# EAGLE design Break (EAGLE 9.6.2)
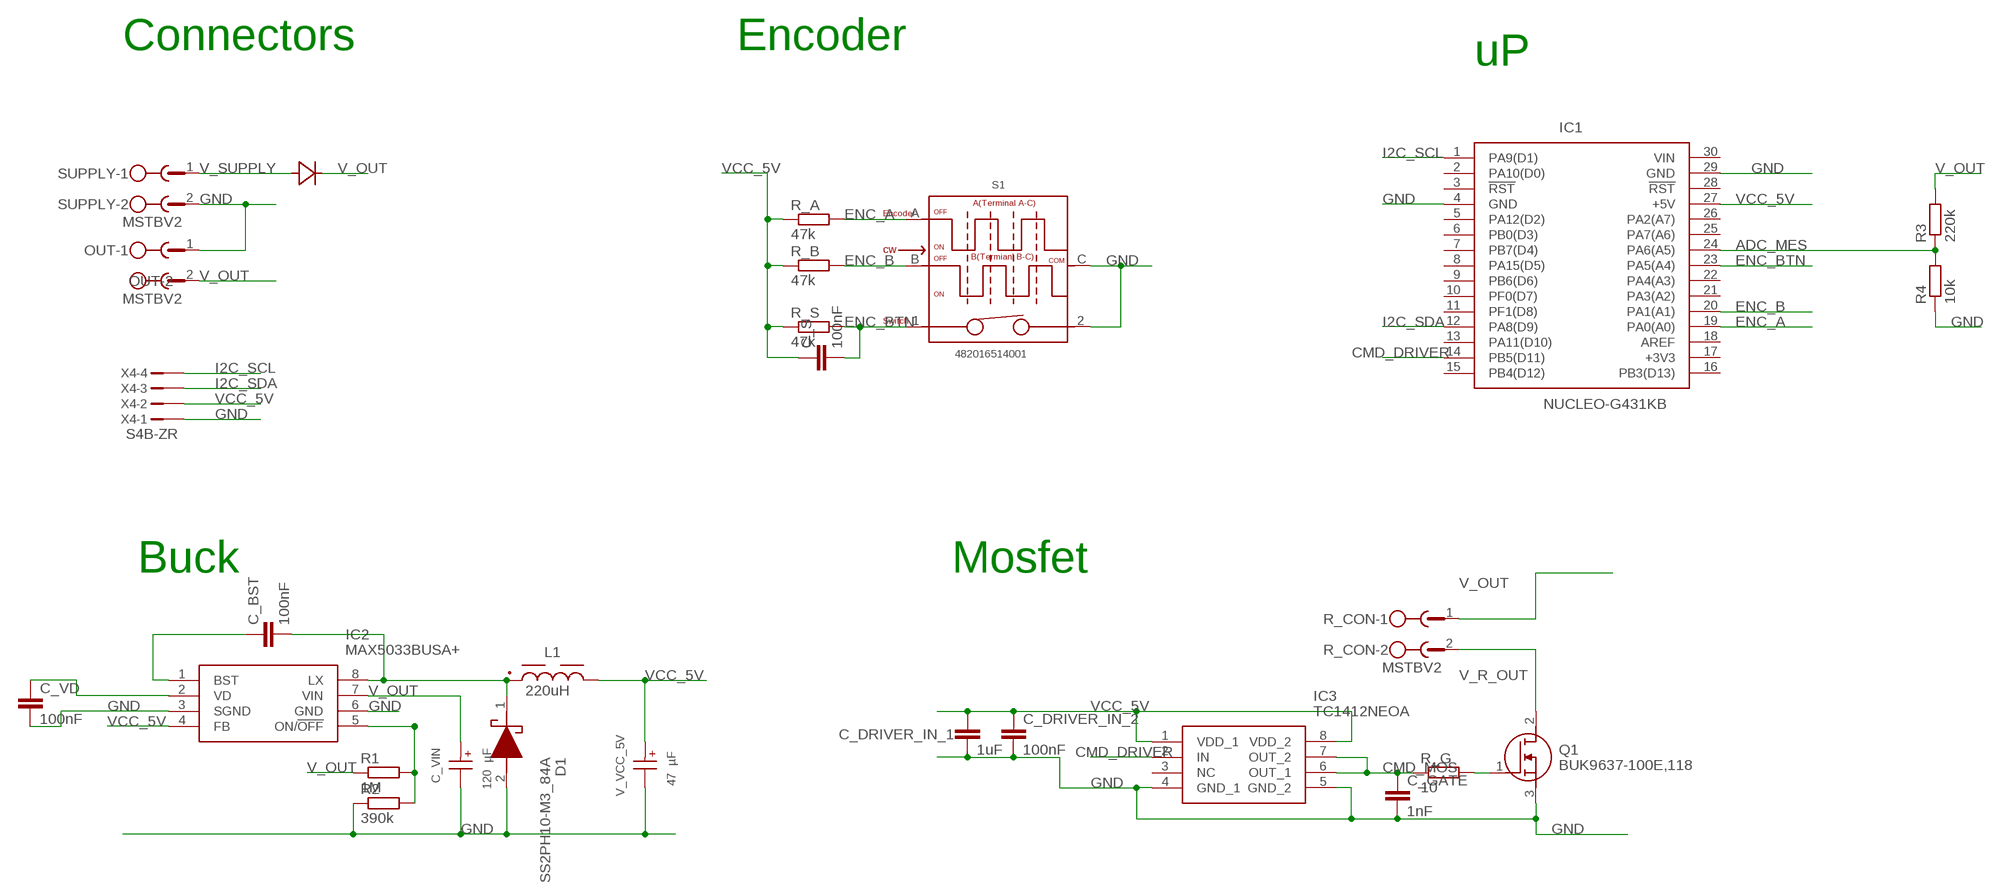
[diagram p0: schematic, sheet 1]

## Parts
C_BST  100nF  C-EUC0603  [C0603]
C_DRIVER_IN_1  1uF  C-EUC0603  [C0603]
C_DRIVER_IN_2  100nF  C-EUC0603  [C0603]
C_GATE  1nF  C-EUC0603  [C0603]
C_S  100nF  C-EUC0603  [C0603]
C_VD  100nF  C-EUC0603  [C0603]
C_VIN  120 µF  WCAP-ATG8_18X41_860011381013  [WCAP-ATG8_18X41X7.5(DXL)]
D1  SS2PH10-M3_84A  [DO-220AA]
IC1  NUCLEO-G431KB  [DIPS1524W66P254L5029H1500Q30N]
IC2  MAX5033BUSA+  [SOIC127P600X175-8N]
IC3  TC1412NEOA  [SOIC127P600X175-8N]
L1  220uH  WE-PDA_1260_784771221  [WE-PDA_1260]
OUT  MSTBV2  [MSTBV2]
Q1  BUK9637-100E,118  [PSMN4R480BS118]
R1  1M  R-EU_R0603  [R0603]
R2  390k  R-EU_R0603  [R0603]
R3  220k  R-EU_R0603  [R0603]
R4  10k  R-EU_R0603  [R0603]
R_A  47k  R-EU_R0603  [R0603]
R_B  47k  R-EU_R0603  [R0603]
R_CON  MSTBV2  [MSTBV2]
R_G  10  R-EU_R1206  [R1206]
R_S  47k  R-EU_R0603  [R0603]
S1  482016514001  [WS-ENTV_4820XX514001]
SUPPLY  MSTBV2  [MSTBV2]
U$1  VS-15TG060S-M3  [SMD-220]
V_VCC_5V  47 µF  WCAP-ASLL_6.3X5.5_865060443004  [WCAP-ASLL_6.3X5.5(DXL)]
X4  S4B-ZR  [S4B-ZR]

## Nets
ADC_MES: IC1.24(PA6(A5)) R3.1 R4.2
CMD_DRIVER: IC1.14(PB5(D11)) IC3.2(IN)
CMD_MOS: C_GATE.1 IC3.6(OUT_1) IC3.7(OUT_2) R_G.1
ENC_A: IC1.19(PA0(A0)) R_A.2 S1.A
ENC_B: IC1.20(PA1(A1)) R_B.2 S1.B
ENC_BTN: C_S.2 IC1.23(PA5(A4)) R_S.2 S1.1
GND: C_DRIVER_IN_1.2 C_DRIVER_IN_2.2 C_GATE.2 C_VD.2 C_VIN.2(-) D1.2(A) IC1.4(GND) IC1.29(GND) IC2.3(SGND) IC2.6(GND) IC3.4(GND_1) IC3.5(GND_2) OUT.1 Q1.3(S) R2.1 R4.1 S1.2 S1.C(COM) SUPPLY.2 V_VCC_5V.2(-) X4.1
I2C_SCL: IC1.1(PA9(D1)) X4.4
I2C_SDA: IC1.12(PA8(D9)) X4.3
N$1: Q1.1(G) R_G.2
N$2: C_BST.2 D1.1(K) IC2.8(LX) L1.1
N$3: C_VD.1 IC2.2(VD)
N$4: C_BST.1 IC2.1(BST)
N$5: IC2.5(ON/!OFF) R1.2 R2.2
V_OUT [High_Voltage]: C_VIN.1(+) IC2.7(VIN) OUT.2 R1.1 R3.2 R_CON.1 U$1.P$4(C)
V_R_OUT [High_Voltage]: Q1.2(D) R_CON.2
V_SUPPLY [High_Voltage]: SUPPLY.1 U$1.P$3(A)
VCC_5V: C_DRIVER_IN_1.1 C_DRIVER_IN_2.1 C_S.1 IC1.27(+5V) IC2.4(FB) IC3.1(VDD_1) IC3.8(VDD_2) L1.2 R_A.1 R_B.1 R_S.1 V_VCC_5V.1(+) X4.2
Unconnected: IC1.2(PA10(D0)) IC1.3(!RST) IC1.5(PA12(D2)) IC1.6(PB0(D3)) IC1.7(PB7(D4)) IC1.8(PA15(D5)) IC1.9(PB6(D6)) IC1.10(PF0(D7)) IC1.11(PF1(D8)) IC1.13(PA11(D10)) IC1.15(PB4(D12)) IC1.16(PB3(D13)) IC1.17(+3V3) IC1.18(AREF) IC1.21(PA3(A2)) IC1.22(PA4(A3)) IC1.25(PA7(A6)) IC1.26(PA2(A7)) IC1.28(!RST) IC1.30(VIN) IC3.3(NC)

## Notes on the sheet
- Connectors | Encoder
- uP
- Buck | Mosfet

## Library data of the parts
C_BST C_DRIVER_IN_1 C_DRIVER_IN_2 C_GATE C_S C_VD = rcl:C-EU: CAPACITOR, European symbol; SPICEPREFIX: C
C_VIN = Eagle_WCAP-ATG8 (rev20a):WCAP-ATG8_18X41: WCAP-ATG8 Aluminium Electrolytic Capacitors General Purpose +85 °C Characteristics General purpose product series with max. operating temperature of +85 °C Wide range of capacitance value Mounting style: THT Radial Capacitance range: 0.1 µF ‒ 33000 µF Capacitance tolerance: ±20 % Voltage range (UR): 10 ‒ 400 V(DC) Operating temperature: -40 °C up to +85 °C for UR < 400 V(DC) -25 °C up to +85 °C for UR ≥ 400 V(DC) Endurance: 2000 h @ +85 °C Dimensions (DxL) in mm: 5.0 x 11.0 up to 22.0 x 51.0 Recommended soldering: Wave soldering Applications Filtering Smoothing Energy storage Coupling <https://www.we-online.com/catalog/media/o35732v209%20WCAP-ATG8_4C.jpg> Details see: https://www.we-online.com/catalog/en/WCAP-ATG8/ Updated by yingchun,Shan;2020-02-27 2020(C) Würth Elektronik; DATASHEET-URL: https://www.we-online.com/catalog/datasheet/860011381013.pdf; DF: 15%; DIAMETER: 18mm; I-LEAK: 1440uA; I-RIPPLE: 520mA; L: 41mm; OPERATING-TEMPERATURE: -40 °C up to +85 °C; PART-NUMBER: 860011381013; PITCH: 7.5mm; TECHNICAL-REFERENCE: ATAL410121M400DSPS1B000; VR: 400V(DC)
D1 = SamacSys_Parts:SS2PH10-M3_84A: VISHAY - SS2PH10-M3/84A - DIODE, RECTIFIER, SCHOTTKY, 2A, 100V, SM Source: Datasheet <https://www.vishay.com/docs/84682/ss2ph9.pdf>; DESCRIPTION: VISHAY - SS2PH10-M3/84A - DIODE, RECTIFIER, SCHOTTKY, 2A, 100V, SM; HEIGHT: mm; MANUFACTURER_NAME: Vishay; MANUFACTURER_PART_NUMBER: SS2PH10-M3/84A; MOUSER_PART_NUMBER: 625-SS2PH10-M3; MOUSER_PRICE-STOCK: https://www.mouser.co.uk/ProductDetail/Vishay-General-Semiconductor/SS2PH10-M3-84A?qs=2u8eEi%2F8yFWdOPY7KNSV1w%3D%3D
IC1 = NUCLEO-G431KB:NUCLEO-G431KB: STM32 Nucleo-32 development board Source: Datasheet <http://www.st.com/content/ccc/resource/technical/document/data_brief/b1/d8/13/d4/b0/b7/4b/6e/DM00214578.pdf/files/DM00214578.pdf/jcr:content/translations/en.DM00214578.pdf>; ARROW_PART_NUMBER: NUCLEO-F303K8; ARROW_PRICE-STOCK: https://www.arrow.com/en/products/nucleo-f303k8/stmicroelectronics; DESCRIPTION: STM32 Nucleo-32 development board; HEIGHT: 15mm; MANUFACTURER_NAME: STMicroelectronics; MANUFACTURER_PART_NUMBER: NUCLEO-F303K8; RS_PART_NUMBER: 9092862; RS_PRICE-STOCK: http://uk.rs-online.com/web/p/products/9092862
IC2 = SamacSys_Parts:MAX5033BUSA+: Maxim MAX5033BUSA+, Step Down DC-DC Converter, 500mA, 8-Pin SOIC Source: Datasheet <https://componentsearchengine.com/Datasheets/2/MAX5033BUSA .pdf>; DESCRIPTION: Maxim MAX5033BUSA+, Step Down DC-DC Converter, 500mA, 8-Pin SOIC; HEIGHT: 1.75mm; MANUFACTURER_NAME: Maxim Integrated; MANUFACTURER_PART_NUMBER: MAX5033BUSA+; MOUSER_PART_NUMBER: 700-MAX5033BUSA; MOUSER_PRICE-STOCK: https://www.mouser.co.uk/ProductDetail/Maxim-Integrated/MAX5033BUSA%2b?qs=Mqkh4jHMT8w8l7AEeL1jAA%3D%3D
IC3 = SamacSys_Parts:TC1412NEOA: MOSFET Driver 2A High-Speed 16V SOIC8 Source: Datasheet <https://datasheet.datasheetarchive.com/originals/distributors/Datasheets-316/599872.pdf>; DESCRIPTION: MOSFET Driver 2A High-Speed 16V SOIC8; HEIGHT: 1.75mm; MANUFACTURER_NAME: Microchip; MANUFACTURER_PART_NUMBER: TC1412NEOA; MOUSER_PART_NUMBER: 579-TC1412NEOA; MOUSER_PRICE-STOCK: https://www.mouser.co.uk/ProductDetail/Microchip-Technology/TC1412NEOA?qs=QQ%252Byn%2FmNCzzaLr%2FfyL5GWw%3D%3D
L1 = Eagle_WE-PDA (rev20b):WE-PDA_1260: WE-PDA SMD Shielded Power Inductor Characteristics Magnetically shielded version which results in a low leakage field High storage capacity High Saturation currents up to 23 A Very low self-losses at high switching frequency's Wide inductance spectrum available at all sizes Operating Temperature -40 °C up to +125 °C Core Material: NiZn Wire connection: welding technology Applications Multimedia applications Switching regulators with low operating voltages Integrated DC/DC-converter Perfect suitable for switching regulators with extremely high efficiency (> 86 %) Plastic base: Because of the one piece construction these are more suitable for high vibration or shock applications <https://www.we-online.com/catalog/media/o55118v209%20Family_WE-PDA.jpg> Details see: https://www.we-online.com/katalog/en/WE-PDA Updated by Ella Wu 2020-03-18 2020(C) Wurth Elektronik; DATASHEET-URL: https://www.we-online.com/catalog/datasheet/784771221.pdf; FRES: 3.9MHz; IR: 0.99A; ISAT: 1.1A; MOUNT: SMT; PART-NUMBER: 784771221; RDC-MAX: 348mOhm; RDC-TYP: 290mOhm
OUT R_CON SUPPLY = con-phoenix-508:MSTBV2: PHOENIX; MPN: MSTBV 2,5/2-GF-5.08; OC_FARNELL: 1792792; OC_NEWARK: 69R9845
Q1 = SamacSys_Parts:BUK9637-100E,118: MOSFET N-channel TrenchMOS logic level FET Source: Datasheet <https://assets.nexperia.com/documents/data-sheet/BUK9608-55A.pdf>; DESCRIPTION: MOSFET N-channel TrenchMOS logic level FET; HEIGHT: mm; MANUFACTURER_NAME: Nexperia; MANUFACTURER_PART_NUMBER: BUK9637-100E,118; MOUSER_PART_NUMBER: 771-BUK9637-100E118; MOUSER_PRICE-STOCK: https://www.mouser.co.uk/ProductDetail/Nexperia/BUK9637-100E118?qs=1sbE9T7hb3az4Qao%252B75HWw%3D%3D
R1-R4 R_A R_B R_G R_S = rcl:R-EU_: RESISTOR, European symbol; SPICEPREFIX: R
S1 = Eagle_WS-ENTV (rev21a):482016514001: WS-ENTV Mechanical Incremental Encoder Switch Mechanical Properties Torque Encoder:200 gf.cm Operation Force:600 g Travel (Value):0.5 mm General Information Operating Temperature:-40 up to +85 °C Packaging Information Packaging:Tray <https://www.we-online.com/catalog/media/o127908v209%20Family_WS-ENTV_482020714001.jpg> Details see: https://www.we-online.com/catalog/en/ENTV_11X13_75X26_6_THT_SHAFT_WITH_BUSHING/ Updated by Yingchun,Shan, 2020-02-27 2020 (C) Wurth Elektronik; DATASHEET-URL: https://www.we-online.com/catalog/datasheet/482016514001.pdf; DETENT: 30 Positions; ELECTRICAL-LIFE-ENCODER: 15000 Cycles; ELECTRICAL-LIFE-SWITCH: 20000 Cycles; PART-NUMBER: 482016514001; RESOLUTION: 15 Pulse/360 degree
U$1 = Custom:VS-15TG060S-M3
V_VCC_5V = Eagle_WCAP-ASLL (rev20a):WCAP-ASLL_6.3X5.5: WCAP-ASLL Aluminium Electrolytic Capacitors Low Impedance & Long Life +105 °C Characteristics Low impedance and long life product series Mounting style: V-Chip SMT Capacitance range: 1 µF ‒ 6800 µF Capacitance tolerance: ±20 % Voltage range (UR): 6.3 ‒ 450 V(DC) Operating temperature: -55 °C up to +105 °C for UR ≤ 100 V(DC) -40 °C up to +105 °C for UR > 100 V(DC) Endurance: 2000 ‒ 5000 h @ +105 °C Dimensions (DxL) in mm: 4.0 x 5.5 up to 16.0 x 17.0 Recommended soldering: Reflow soldering Applications Long life application & low impedance Input and output capacitor for switched-mode power supply Filtering Smoothing e.g. DC/DC converter, AC/DC converter, satellite receiver, control panel <https://www.we-online.com/catalog/media/o14724v209%20Family_WCAP-ASLL.jpg> Details see: https://www.we-online.com/catalog/en/WCAP-ASLL/ Updated by yingchun,Shan;2020-03-03 2020(C) Würth Elektronik; DATASHEET-URL: https://www.we-online.com/catalog/datasheet/865060443004.pdf; DF: 14%; DIAMETER: 6.3mm; I-LEAK: 11.75uA; I-RIPPLE: 230mA; L: 5.5mm; OPERATING-TEMPERATURE: -55 °C up to +105 °C; PART-NUMBER: 865060443004; TECHNICAL-REFERENCE: ASED055470M025DVCTBB000; VR: 25V(DC); Z: 0.44Ohm
X4 = con-jst:?4B-ZR: ZH CONNECTOR 1.5 mm, 4 pin 1 row Source: http://www.jst.com .. eZH.pdf; MF: FARNELL; MPN: S4B-ZR(LF)(SN); OC_FARNELL: 9491830; OC_NEWARK: 38K8076

## Net classes
0 default: width 0.3 mm, clearance 0.3 mm
1 High_Voltage: width 0.6 mm, clearance 0.6 mm

## Board
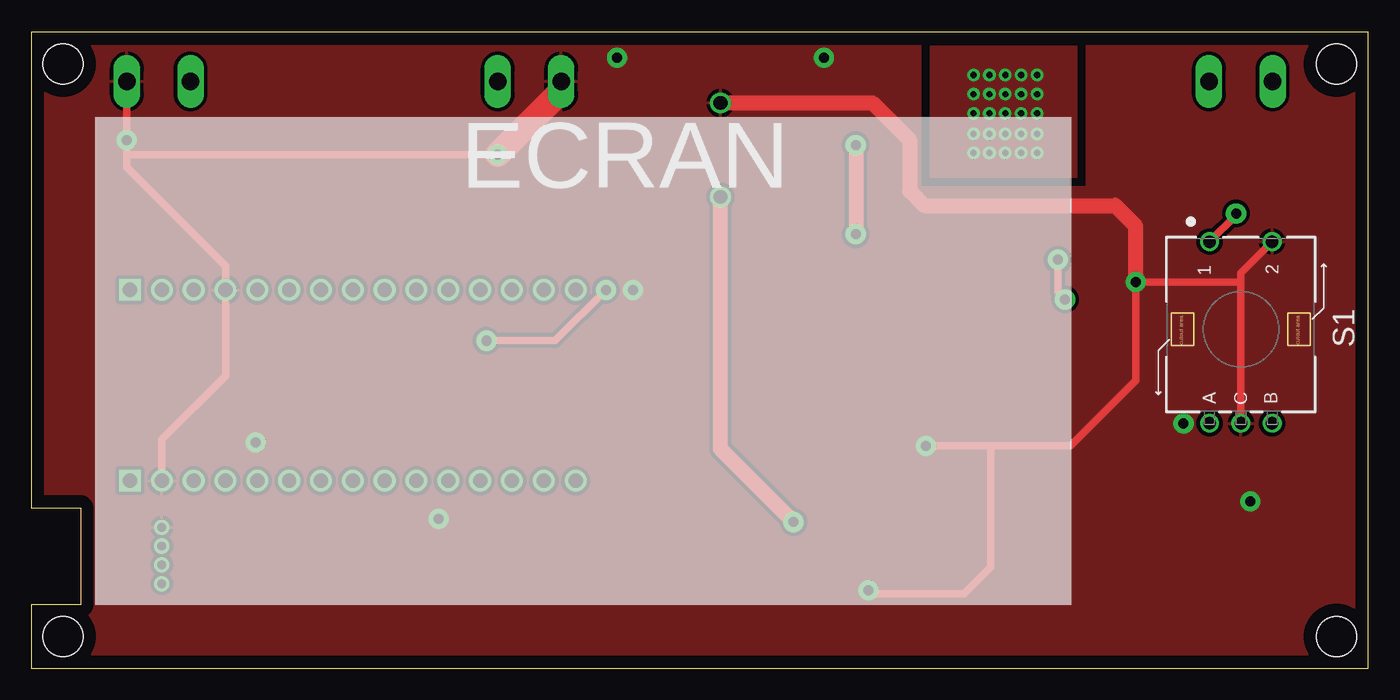
[diagram p1: board, top side]
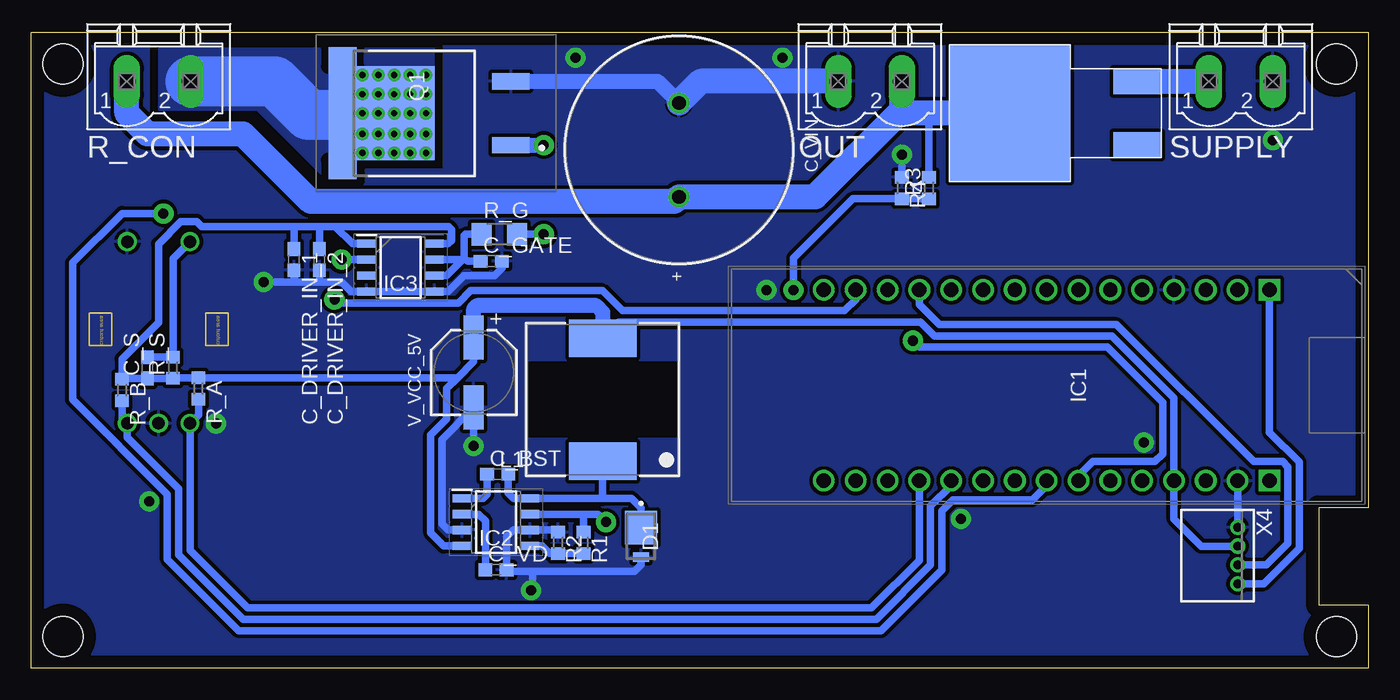
[diagram p2: board, bottom side, seen from below]

Size 106.68 x 50.8 mm. Coordinates in mm from the lower left corner, seen from the top.
Outline: 0,50.8 0,12.83 3.94,12.83 3.94,5.08 0,5.08 0,0 106.68,0 106.68,50.8 0,50.8
Copper layers (1*16): Top 0.035mm / dielectric 1.5mm / Bottom 0.035mm
Design rules "default *": minimum track width 0.3mm, minimum drill 0.5mm, track to track 0.3mm, track to pad 0.3mm, pad to pad 0.3mm, via to via 0.3mm, smd to smd 0.3mm, copper to edge 40mil, drill to drill 6mil, minimum pad ring 10mil, minimum via ring 8mil, stop-mask expansion 4mil, vias tented up to drill 0mil, thermal gap 0.3mm
Holes 3.2 mm at 2.54,2.54 2.54,48.26 104.14,48.26 104.14,2.54

### Footprints (pad centres in the part's own frame; a part is rotated, then mirrored left to right if it is on the bottom)
C0603 = smd 1.1 x 1: 1 -0.85,0; 2 0.85,0
WCAP-ATG8_18X41X7.5(DXL) = drill 1.1: 1 3.75,0; 2 -3.75,0
DO-220AA = smd 2.67 x 2.54: 1 -0.699,0 | smd 0.762 x 1.27: 2 1.653,0
DIPS1524W66P254L5029H1500Q30N = drill 1.15 pad 1.725 square: 1 -7.62,17.78; 30 7.62,17.78 | drill 1.15 pad 1.725: 2 -7.62,15.24; 3 -7.62,12.7; 4 -7.62,10.16; 5 -7.62,7.62; 6 -7.62,5.08; 7 -7.62,2.54; 8 -7.62,0; 9 -7.62,-2.54; 10 -7.62,-5.08; 11 -7.62,-7.62; 12 -7.62,-10.16; 13 -7.62,-12.7; 14 -7.62,-15.24; 15 -7.62,-17.78; 16 7.62,-17.78; 17 7.62,-15.24; 18 7.62,-12.7; 19 7.62,-10.16; 20 7.62,-7.62; 21 7.62,-5.08; 22 7.62,-2.54; 23 7.62,0; 24 7.62,2.54; 25 7.62,5.08; 26 7.62,7.62; 27 7.62,10.16; 28 7.62,12.7; 29 7.62,15.24
SOIC127P600X175-8N = smd 1.5 x 0.65: 1 -2.7,1.905; 2 -2.7,0.635; 3 -2.7,-0.635; 4 -2.7,-1.905; 5 2.7,-1.905; 6 2.7,-0.635; 7 2.7,0.635; 8 2.7,1.905
WE-PDA_1260 = smd 5.4 x 3: 1 0,4.9; 2 0,-4.9
MSTBV2 = drill 1.397 long: 1 -2.54,0; 2 2.54,0
PSMN4R480BS118 = smd 1.3 x 3: 1 -2.54,-10.325; 3 2.54,-10.325 | smd 7.5 x 8.45: 2 0,0 | smd 1.55 x 2.25: 4 -4.5,3.1; 5 4.5,3.1
R0603 = smd 1 x 1.1: 1 -0.85,0; 2 0.85,0
R1206 = smd 1.6 x 1.803: 1 -1.422,0; 2 1.422,0
WS-ENTV_4820XX514001 = drill 1: 1 -7,-2.5; 2 -7,2.5; A 7.5,-2.5; B 7.5,2.5; C 7.5,0
SMD-220 = smd 2.032 x 3.81: P$1 -2.54,-5.08; P$3 2.54,-5.08 | smd 10.922 x 9.652: P$4 0,5.08
WCAP-ASLL_6.3X5.5(DXL) = smd 3.5 x 1.6: 1 2.8,0; 2 -2.8,0
S4B-ZR = drill 0.7 pad 1.1: 1 -2.25,0; 2 -0.75,0; 3 0.75,0; 4 2.25,0

### Placement (x,y rotation side)
C_BST  69.47,15.49 0 bottom
C_DRIVER_IN_1  85.72,32.64 270 bottom
C_DRIVER_IN_2  83.69,32.64 270 bottom
C_GATE  69.98,32.51 0 bottom
C_S  97.41,24 90 bottom
C_VD  69.6,7.87 0 bottom
C_VIN  54.99,41.4 270 bottom
D1  58.04,10.54 270 bottom
IC1  25.65,22.61 270 bottom
IC2  69.6,11.68 0 bottom
IC3  77.22,32 0 bottom
L1  61.09,21.46 180 bottom
OUT  39.75,46.86 0 bottom
Q1  78.74,44.32 90 bottom
R1  62.61,10.03 270 bottom
R2  64.64,10.03 270 bottom
R3  35.05,38.35 90 bottom
R4  37.21,38.35 270 bottom
R_A  93.34,22.35 270 bottom
R_B  99.44,22.23 270 bottom
R_CON  96.52,46.86 0 bottom
R_G  69.34,34.67 0 bottom
R_S  95.38,24 90 bottom
S1  96.52,27.08 270 top
SUPPLY  10.16,46.86 0 bottom
U$1  23.5,44.32 90 bottom
V_VCC_5V  71.37,23.62 90 bottom
X4  10.41,9.02 270 bottom

### Tracks (layer width: path | path; a pad name or v marks a point on that pad's centre or on a via)
ADC_MES  (via drill 0.8 pad 1.6)
  Top 0.6: v45.85,30.23 41.78,26.16 v36.32,26.16
  Bottom 0.6: v45.85,30.23 45.85,32.77 41.11,37.5 R4.2 R3.1 | IC1.24 23.11,15.37 21.97,16.51 17.03,16.51 16.39,17.14 16.39,21.22 20.83,25.65 35.81,25.65 v36.32,26.16
CMD_DRIVER  (via drill 0.8 pad 1.6)
  Top 0.6: v82.5,29.46 81.92,30.04 v81.92,32.64
  Bottom 0.6: IC3.2 v81.92,32.64 | IC1.14 40.89,29.46 41.78,28.57 59.52,28.57 61.1,30.16 71.62,30.16 72.6,29.17 82.21,29.17 v82.5,29.46
CMD_MOS
  Bottom 0.6: IC3.6 73.53,31.37 72.26,32.64 | IC3.7 72.26,32.64 | R_G.1 72.01,34.67 72.14,34.54 72.14,32.77 | 72.14,32.77 72.26,32.64 | C_GATE.1 71.88,32.51 72.14,32.77
ENC_A
  Bottom 0.6: R_A.2 93.34,20.25 S1.A 94.02,9.44 89.41,4.83 39.62,4.83 35.81,8.64 IC1.19
ENC_B
  Bottom 0.6: R_B.2 99.44,20 S1.B 99.02,18.43 94.92,14.33 94.92,9.06 89.78,3.93 39.25,3.93 34.91,8.26 34.91,12.96 33.27,14.61 IC1.20
ENC_BTN  (via drill 0.8 pad 1.6)
  Top 0.6: S1.1 96.14,36.2 v96.14,36.32
  Bottom 0.6: C_S.2 R_S.2 95.38,32.72 S1.1 | IC1.23 25.65,14.61 26.8,13.46 33.12,13.46 34.01,12.57 34.01,7.89 38.88,3.03 90.15,3.03 95.82,8.69 95.82,13.9 103.38,21.46 103.38,32.38 99.44,36.32 v96.14,36.32
GND  (via drill 0.8 pad 1.6)
  Top 0.6: S1.C 96.52,30.86 | 96.52,30.86 96.52,31.58 S1.2 | IC1.29 10.41,18.29 15.49,23.37 IC1.4 15.49,32.13 7.62,40.01 7.62,41.02 | SUPPLY.2 7.62,41.02 | v37.21,41.02 7.62,41.02 | 96.52,30.86 v88.14,30.86 88.14,22.99 82.93,17.78 76.58,17.78 | v71.37,17.78 76.58,17.78 | 76.58,17.78 76.58,8.13 74.42,5.97 66.8,5.97 v66.8,6.23
  Top 1.2: v88.14,30.86 88.14,35.31 86.49,36.96 71.25,36.96 70.1,38.1 70.1,42.16 67.12,45.15 C_VIN.2
  Top 2: OUT.1 42.29,46.1 v37.21,41.02
  Bottom 0.6: C_GATE.2 69.13,31.96 69.72,31.37 72.14,31.37 73.41,30.1 IC3.5 IC3.4 81.15,30.1 81.92,30.86 83.57,30.86 | 83.57,30.86 85.47,30.86 | 85.47,30.86 85.72,31.11 C_DRIVER_IN_1.2 | C_DRIVER_IN_2.2 83.69,30.99 83.57,30.86 | R2.1 64.81,11.05 IC2.6 68.2,11.05 68.75,10.5 C_VD.2 68.62,7.75 66.67,7.75 | IC2.3 73.41,11.05 73.91,11.56 73.91,18.28 V_VCC_5V.2 v71.37,17.78 | D1.2 58.04,8.26 58.55,7.75 66.67,7.75 | X4.1 IC1.29 | R4.1 v37.21,41.02 | v88.14,30.86 85.47,30.86 | v66.8,6.23 66.67,6.35 66.67,7.75
  Bottom 1.2: Q1.3 56.7,46.86 C_VIN.2
  Bottom 2: OUT.1 53.28,46.86 C_VIN.2
  other vias: 32.51,11.94 46.74,48.77 63.25,48.77 97.28,13.34 91.95,19.56 17.91,18.03 7.62,42.16 48.01,30.23
  pour Top (rank 2): 0,0 106.68,0 106.68,50.8 84.2,50.8 84.2,38.48 70.99,38.48 70.99,50.8 0,50.8
  pour Bottom (rank 2): 0,0 106.68,0 106.68,50.8 97.28,50.8 97.28,43.81 89.03,43.81 83.44,38.23 80.52,38.23 80.01,38.73 80.01,39.88 73.79,39.88 73.79,50.8 0,50.8 0,12.83 3.94,12.83 3.94,5.08 0,5.08
I2C_SCL
  Bottom 0.6: X4.4 8.34,6.77 5.51,9.6 5.51,16.47 7.87,18.83 IC1.1
I2C_SDA
  Bottom 0.6: X4.3 8.12,8.27 6.41,9.97 6.41,16.1 6.82,16.51 9.14,16.51 20.09,27.45 34.23,27.45 35.81,29.03 IC1.12
N$1  (via drill 0.8 pad 1.6)
  Top 1.2: v65.79,41.78 v65.79,34.67
  Bottom 0.6: v65.79,34.67 R_G.2
  Bottom 1.2: Q1.1 v65.79,41.78
N$2
  Bottom 0.6: C_BST.2 68.62,14.01 68.2,13.59 IC2.8 60.96,13.59 | L1.1 61.09,13.72 60.96,13.59 | D1.1 58.04,12.83 58.8,13.59 60.96,13.59
N$3
  Bottom 0.6: C_VD.1 70.45,11.77 70.99,12.32 IC2.2
N$4
  Bottom 0.6: IC2.1 70.61,13.59 70.32,13.88 C_BST.1
N$5
  Bottom 0.6: R1.2 R2.2 65.32,9.18 65.91,9.78 IC2.5
V_OUT  (via drill 0.8 pad 1.6)
  Top 1.2: v60.83,11.68 54.99,17.53 C_VIN.1
  Bottom 0.6: IC2.7 62.61,12.32 | 62.61,12.32 R1.1 | 62.61,12.32 61.47,12.32 v60.83,11.68 | R3.2 35.05,44.32
  Bottom 2: U$1.P$4 35.05,44.32 37.21,44.32 37.21,44.58 | 37.21,44.58 OUT.2 | 37.21,44.58 44.14,37.65 C_VIN.1 55.37,37.27 84.39,37.27 89.79,42.67 97.41,42.67 99.06,44.32 R_CON.1
V_R_OUT  (via drill 0.5 pad 1)
  Bottom 0.6: Q1.2 76.45,46.61 v76.45,47.37 | v77.72,47.37 v77.72,45.85 77.72,45.34 Q1.2 | 78.74,45.85 78.74,47.12 v78.99,47.37 | 78.74,45.85 v80.26,47.37 | Q1.2 77.22,45.85 v76.45,45.85 | Q1.2 78.74,45.85 | Q1.2 v80.26,45.85 | Q1.2 v78.99,44.32 | Q1.2 v77.72,44.32 | Q1.2 v76.45,44.32 | Q1.2 78.11,44.32 v76.45,42.67 | Q1.2 78.74,42.93 v78.99,42.67 | Q1.2 78.74,44.2 v80.26,42.67 | Q1.2 77.72,43.31 v77.72,42.67 v77.72,41.15 | Q1.2 78.74,41.4 v78.99,41.15 | Q1.2 78.74,42.67 v80.26,41.15 | Q1.2 77.09,42.67 v75.18,42.67 | Q1.2 v75.18,44.32 | Q1.2 76.71,44.32 v75.18,45.85 | Q1.2 78.23,44.32 v75.18,47.37 | Q1.2 78.74,43.43 v76.45,41.15 | Q1.2 75.56,41.15 v75.18,41.15 | Q1.2 78.74,45.59 v78.99,45.85
  Bottom 2: v80.26,45.85 81.03,46.61 | 93.98,46.61 R_CON.2
  Bottom 4: 80.17,45.75 Q1.2 78.87,44.2 84.58,44.2 87.25,46.86 R_CON.2
  other vias: 80.26,44.32
  pour Bottom (no thermals): 74.55,49.53 96.52,49.53 96.52,44.58 88.65,44.58 83.06,38.99 80.77,38.99 80.77,40.64 74.55,40.64
  pour Top (no thermals): 71.75,49.78 83.44,49.78 83.44,39.24 71.75,39.24
V_SUPPLY
  Bottom 2: U$1.P$3 SUPPLY.1
VCC_5V
  Bottom 0.6: IC3.8 73.41,33.91 73.15,34.16 73.15,35.05 73.39,35.29 82.42,35.29 | IC3.1 81.04,33.91 82.42,35.29 | 83.69,35.29 82.42,35.29 | C_DRIVER_IN_1.1 85.72,35.29 | C_DRIVER_IN_2.1 83.69,35.29 | IC2.4 73.79,9.78 74.81,10.81 74.81,18.66 73.53,19.94 73.53,22.35 72.68,23.2 | V_VCC_5V.1 71.37,24.51 72.68,23.2 | 72.68,23.2 R_A.1 95.33,23.2 R_S.1 C_S.1 99.36,23.15 R_B.1 99.44,24.72 96.53,27.63 96.53,33.9 94.74,35.69 93.47,35.69 93.08,35.29 85.72,35.29 | 83.69,35.29 85.72,35.29 | X4.2 13.32,9.77 15.49,11.94 IC1.27 15.49,21.59 20.46,26.55 34.61,26.55 35.73,27.68 59.77,27.68 L1.2
  Bottom 1.2: V_VCC_5V.1 71.37,28.7 71.12,28.96 61.59,28.96 61.09,28.45 L1.2

### Text on the board
tPlace: ECRAN